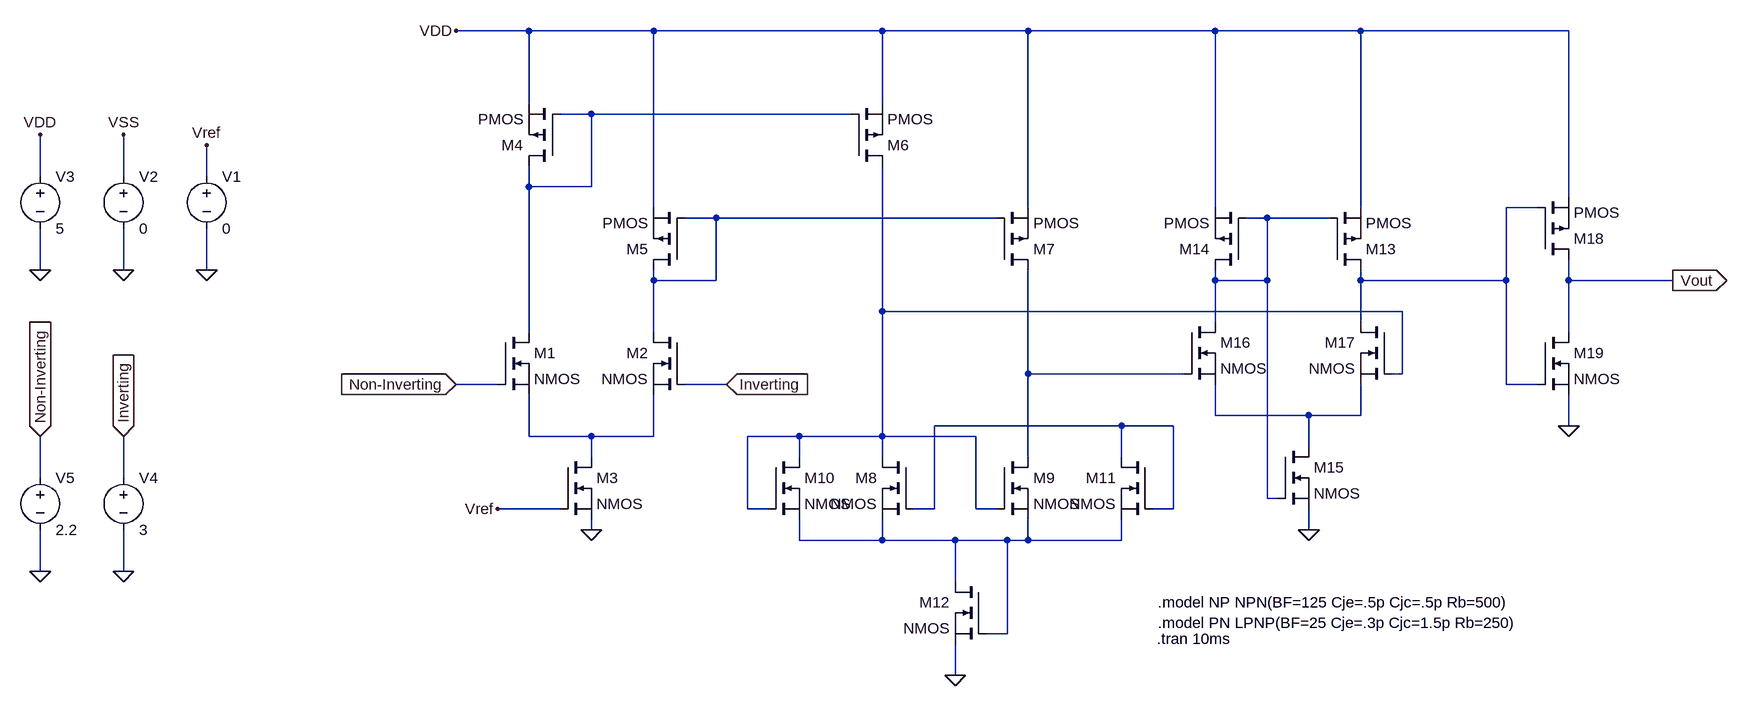
[diagram p0: schematic m_Comparator_VLSI.asc]
m_Comparator_VLSI.asc, the LTspice schematic file:
Version 4
SHEET 1 2064 728
WIRE 128 -304 16 -304
WIRE 320 -304 128 -304
WIRE 672 -304 320 -304
WIRE 896 -304 672 -304
WIRE 1184 -304 896 -304
WIRE 1408 -304 1184 -304
WIRE 1728 -304 1408 -304
WIRE 128 -192 128 -304
WIRE 672 -192 672 -304
WIRE 224 -176 176 -176
WIRE 624 -176 224 -176
WIRE -624 -80 -624 -144
WIRE -496 -80 -496 -144
WIRE -368 -80 -368 -128
WIRE 128 -64 128 -96
WIRE 224 -64 224 -176
WIRE 224 -64 128 -64
WIRE 1728 -48 1728 -304
WIRE 320 -32 320 -304
WIRE 896 -32 896 -304
WIRE 1184 -32 1184 -304
WIRE 1408 -32 1408 -304
WIRE 1680 -32 1632 -32
WIRE 416 -16 368 -16
WIRE 848 -16 416 -16
WIRE 1264 -16 1232 -16
WIRE 1360 -16 1264 -16
WIRE -624 64 -624 0
WIRE -496 64 -496 0
WIRE -368 64 -368 0
WIRE 320 80 320 64
WIRE 416 80 416 -16
WIRE 416 80 320 80
WIRE 1184 80 1184 64
WIRE 1264 80 1264 -16
WIRE 1264 80 1184 80
WIRE 1408 80 1408 64
WIRE 1632 80 1632 -32
WIRE 1632 80 1408 80
WIRE 1728 80 1728 48
WIRE 1888 80 1728 80
WIRE 672 128 672 -96
WIRE 1472 128 672 128
WIRE 1184 144 1184 80
WIRE 1408 144 1408 80
WIRE 128 160 128 -64
WIRE 320 160 320 80
WIRE 1728 160 1728 80
WIRE 896 224 896 64
WIRE 1136 224 896 224
WIRE 1472 224 1472 128
WIRE 1472 224 1456 224
WIRE 80 240 16 240
WIRE 432 240 368 240
WIRE 1632 240 1632 80
WIRE 1680 240 1632 240
WIRE 1184 288 1184 240
WIRE 1328 288 1184 288
WIRE 1408 288 1408 240
WIRE 1408 288 1328 288
WIRE 1040 304 752 304
WIRE 1120 304 1040 304
WIRE 1728 304 1728 256
WIRE 128 320 128 256
WIRE 224 320 128 320
WIRE 320 320 320 256
WIRE 320 320 224 320
WIRE 544 320 464 320
WIRE 672 320 672 128
WIRE 672 320 544 320
WIRE 816 320 672 320
WIRE 1328 336 1328 288
WIRE 224 352 224 320
WIRE 544 352 544 320
WIRE 672 352 672 320
WIRE 896 352 896 224
WIRE 1040 352 1040 304
WIRE -624 384 -624 320
WIRE -496 384 -496 320
WIRE 1264 416 1264 80
WIRE 1280 416 1264 416
WIRE 176 432 80 432
WIRE 464 432 464 320
WIRE 496 432 464 432
WIRE 752 432 752 304
WIRE 752 432 720 432
WIRE 816 432 816 320
WIRE 848 432 816 432
WIRE 1120 432 1120 304
WIRE 1120 432 1088 432
WIRE 224 464 224 448
WIRE 1328 464 1328 432
WIRE 544 480 544 448
WIRE 672 480 672 448
WIRE 672 480 544 480
WIRE 784 480 672 480
WIRE 864 480 784 480
WIRE 896 480 896 448
WIRE 896 480 864 480
WIRE 1040 480 1040 448
WIRE 1040 480 896 480
WIRE -624 528 -624 464
WIRE -496 528 -496 464
WIRE 784 544 784 480
WIRE 864 624 864 480
WIRE 864 624 832 624
WIRE 784 688 784 640
FLAG 224 464 0
FLAG -368 -128 Vref
FLAG -368 64 0
FLAG 80 432 Vref
FLAG 16 240 Non-Inverting
IOPIN 16 240 In
FLAG 432 240 Inverting
IOPIN 432 240 In
FLAG -496 64 0
FLAG -624 64 0
FLAG -496 -144 VSS
FLAG -624 -144 VDD
FLAG 16 -304 VDD
FLAG 784 688 0
FLAG 1328 464 0
FLAG 1728 304 0
FLAG 1888 80 Vout
IOPIN 1888 80 Out
FLAG -496 528 0
FLAG -624 528 0
FLAG -624 320 Non-Inverting
IOPIN -624 320 In
FLAG -496 320 Inverting
IOPIN -496 320 In
SYMBOL nmos 80 160 R0
SYMATTR InstName M1
SYMBOL nmos 368 160 M0
SYMATTR InstName M2
SYMBOL nmos 176 352 R0
SYMATTR InstName M3
SYMBOL voltage -368 -96 R0
WINDOW 123 0 0 Left 0
WINDOW 39 0 0 Left 0
SYMATTR InstName V1
SYMATTR Value 0
SYMBOL pmos 176 -96 R180
SYMATTR InstName M4
SYMBOL pmos 368 64 R180
SYMATTR InstName M5
SYMBOL pmos 624 -96 M180
SYMATTR InstName M6
SYMBOL pmos 848 64 M180
SYMATTR InstName M7
SYMBOL voltage -496 -96 R0
SYMATTR InstName V2
SYMATTR Value 0
SYMBOL voltage -624 -96 R0
SYMATTR InstName V3
SYMATTR Value 5
SYMBOL nmos 720 352 M0
SYMATTR InstName M8
SYMBOL nmos 848 352 R0
SYMATTR InstName M9
SYMBOL nmos 496 352 R0
SYMATTR InstName M10
SYMBOL nmos 1088 352 M0
SYMATTR InstName M11
SYMBOL nmos 832 544 M0
SYMATTR InstName M12
SYMBOL pmos 1360 64 M180
SYMATTR InstName M13
SYMBOL pmos 1232 64 R180
SYMATTR InstName M14
SYMBOL nmos 1280 336 R0
SYMATTR InstName M15
SYMBOL nmos 1136 144 R0
SYMATTR InstName M16
SYMBOL nmos 1456 144 M0
SYMATTR InstName M17
SYMBOL pmos 1680 48 M180
SYMATTR InstName M18
SYMBOL nmos 1680 160 R0
SYMATTR InstName M19
SYMBOL voltage -496 368 R0
WINDOW 123 0 0 Left 0
WINDOW 39 0 0 Left 0
SYMATTR InstName V4
SYMATTR Value 3
SYMBOL voltage -624 368 R0
SYMATTR InstName V5
SYMATTR Value 2.2
TEXT 1096 576 Left 2 !.model NP NPN(BF=125 Cje=.5p Cjc=.5p Rb=500)\n.model PN LPNP(BF=25 Cje=.3p Cjc=1.5p Rb=250)
TEXT 1094 632 Left 2 !.tran 10ms

The netlist it stands for:
* m_Comparator_VLSI.asc
M1 N001 Non-Inverting N009 N009 NMOS
M2 N003 Inverting N009 N009 NMOS
M3 N009 Vref 0 0 NMOS
V1 Vref 0 0
M4 N001 N001 VDD VDD PMOS
M5 N003 N003 VDD VDD PMOS
M6 N005 N001 VDD VDD PMOS
M7 N006 N003 VDD VDD PMOS
V2 VSS 0 0
V3 VDD 0 5
M8 N005 N008 N010 N010 NMOS
M9 N006 N005 N010 N010 NMOS
M10 N005 N005 N010 N010 NMOS
M11 N008 N008 N010 N010 NMOS
M12 N010 N010 0 0 NMOS
M13 N002 N004 VDD VDD PMOS
M14 N004 N004 VDD VDD PMOS
M15 N007 N004 0 0 NMOS
M16 N004 N006 N007 N007 NMOS
M17 N002 N005 N007 N007 NMOS
M18 Vout N002 VDD VDD PMOS
M19 Vout N002 0 0 NMOS
V4 Inverting 0 3
V5 Non-Inverting 0 2.2
.model NMOS NMOS
.model PMOS PMOS
.lib standard.mos
.model NP NPN(BF=125 Cje=.5p Cjc=.5p Rb=500)
.model PN LPNP(BF=25 Cje=.3p Cjc=1.5p Rb=250)
.tran 10ms
.backanno
.end

* Results of the author's LTspice run, read from the files saved beside the schematic
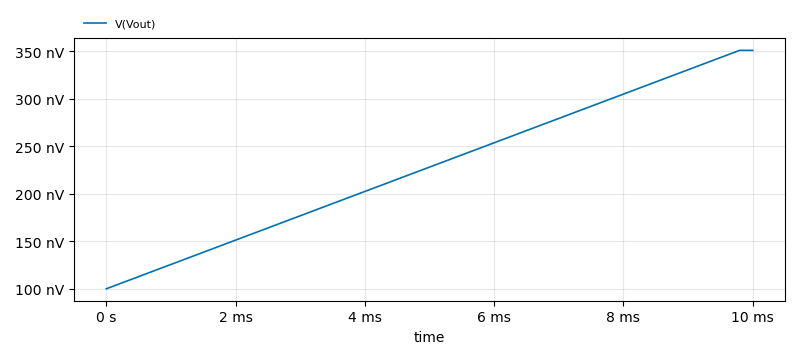
[diagram p1: Transient Analysis of m_Comparator_VLSI.asc, plotted from the saved traces]
* Transient Analysis, 1 run:
*   V(Vout): min 100.1 nV, max 351 nV, average 228.1 nV, rms 260.3 nV, last 351 nV